# EAGLE design z21_2020_3 (EAGLE 8.4.3)
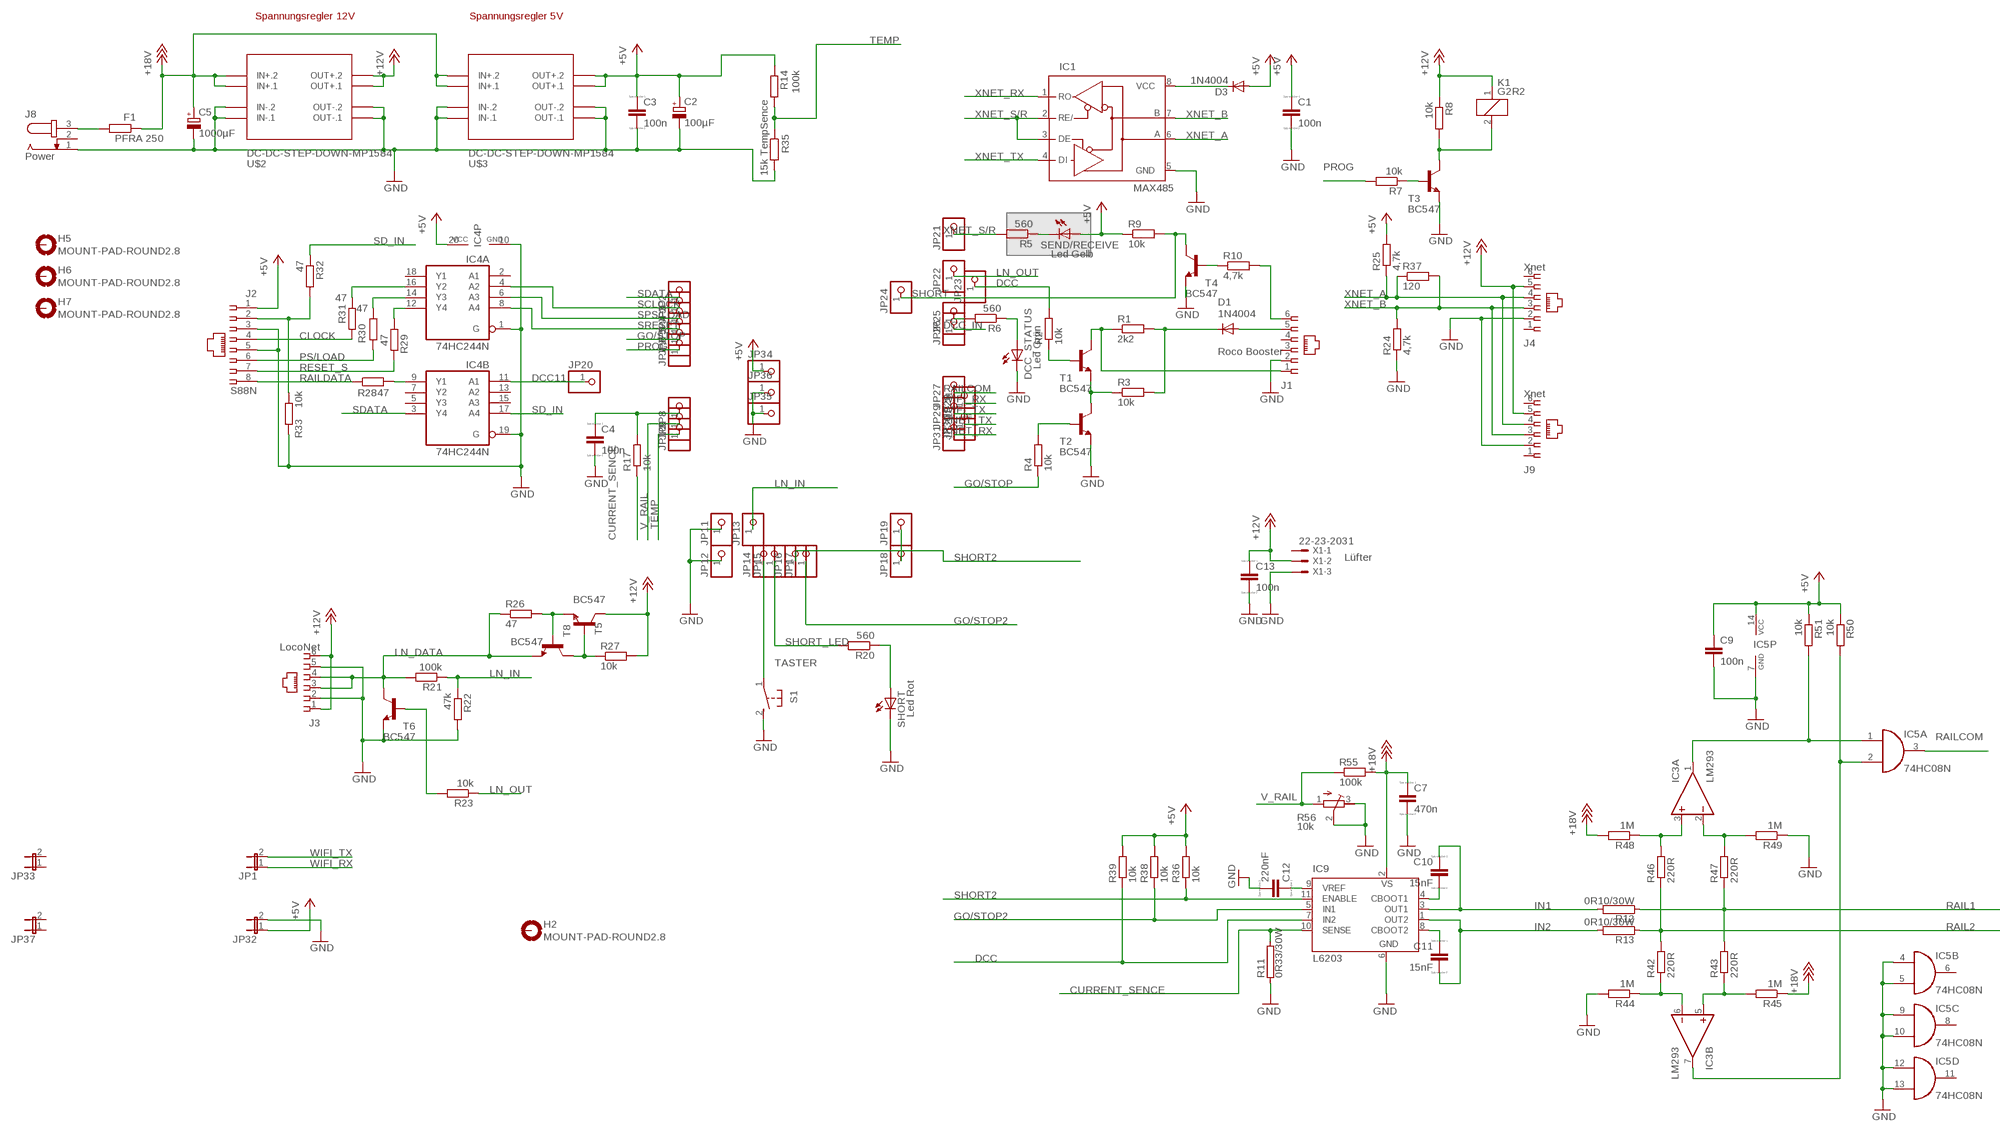
[diagram p0: schematic, sheet 1, part 1 of 2]
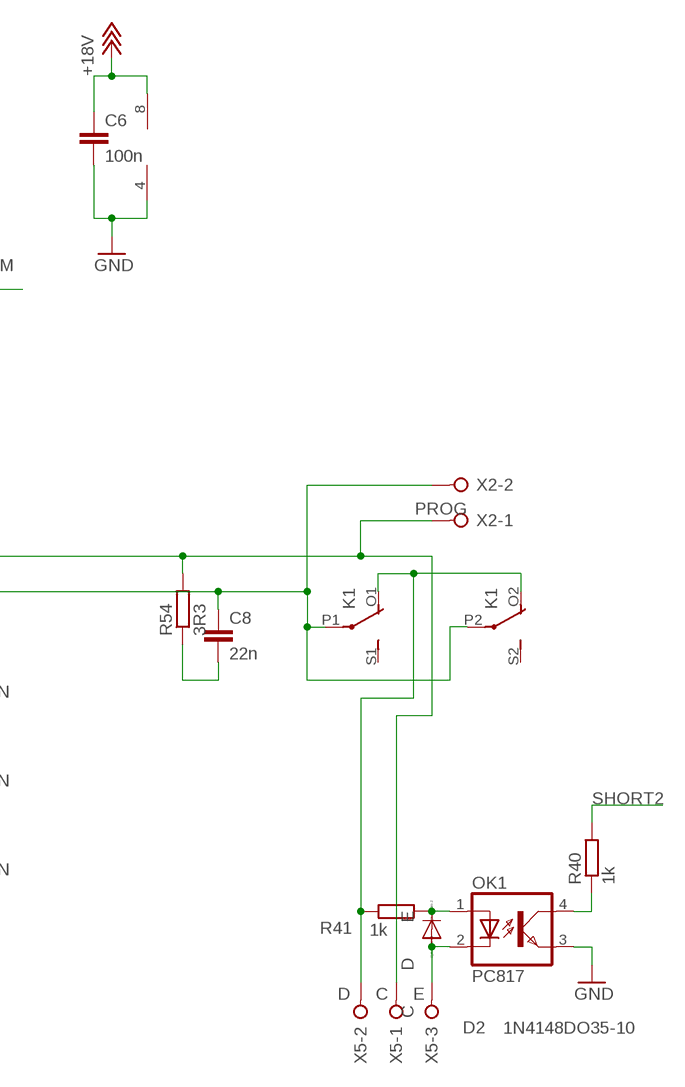
[diagram p1: schematic, sheet 1, part 2 of 2]

## Parts
C1  100n  C-EU050-024X044  [C050-024X044]
C2  100µF  CPOL-EUE3.5-10  [E3,5-10]
C3  100n  C-EU050-024X044  [C050-024X044]
C4  100n  C-EU050-024X044  [C050-024X044]
C5  1000µF  CPOL-EUE5-13  [E5-13]
C6  100n  C-EU050-024X044  [C050-024X044]
C7  470n  C-EU050-024X044  [C050-024X044]
C8  22n  C-EU050-024X044  [C050-024X044]
C9  100n  C-EU050-024X044  [C050-024X044]
C10  15nF  C-EU050-025X075  [C050-025X075]
C11  15nF  C-EU050-025X075  [C050-025X075]
C12  220nF  C-EU050-025X075  [C050-025X075]
C13  100n  C-EU050-024X044  [C050-024X044]
D1  1N4004  [DO41-10]
D2  1N4148DO35-10  [DO35-10]
D3  1N4004  [DO41-10]
DCC_STATUS  Led Grün  LEDLD260  [LD260]
F1  PFRA 250  R-EU_0204/5  [0204/5]
H2  MOUNT-PAD-ROUND2.8  [2,8-PAD]
H5  MOUNT-PAD-ROUND2.8  [2,8-PAD]
H6  MOUNT-PAD-ROUND2.8  [2,8-PAD]
H7  MOUNT-PAD-ROUND2.8  [2,8-PAD]
IC1  MAX485  MAX3468CPA  [DIL08]
IC3  LM293  LM393N  [DIL08]
IC4  74HC244N  [DIL20]
IC5  74HC08N  [DIL14]
IC9  L6203  [MULTIWATT-11]
J1  Roco Booster  520250-3  [520250-3]
J2  S88N  520251-4  [520251-4]
J3  LocoNet  520250-3  [520250-3]
J4  Xnet  520250-3  [520250-3]
J8  Power  JACK-PLUG0  [SPC4077]
J9  Xnet  520250-3  [520250-3]
JP1  JP1E  [JP1]
JP2  PINHD-1X1  [1X01]
JP3  PINHD-1X1  [1X01]
JP4  PINHD-1X1  [1X01]
JP5  PINHD-1X1  [1X01]
JP6  PINHD-1X1  [1X01]
JP7  PINHD-1X1  [1X01]
JP8  PINHD-1X1  [1X01]
JP9  PINHD-1X1  [1X01]
JP10  PINHD-1X1  [1X01]
JP11  PINHD-1X1  [1X01]
JP12  PINHD-1X1  [1X01]
JP13  PINHD-1X1  [1X01]
JP14  PINHD-1X1  [1X01]
JP15  PINHD-1X1  [1X01]
JP16  PINHD-1X1  [1X01]
JP17  PINHD-1X1  [1X01]
JP18  PINHD-1X1  [1X01]
JP19  PINHD-1X1  [1X01]
JP20  PINHD-1X1  [1X01]
JP21  PINHD-1X1  [1X01]
JP22  PINHD-1X1  [1X01]
JP23  PINHD-1X1  [1X01]
JP24  PINHD-1X1  [1X01]
JP25  PINHD-1X1  [1X01]
JP26  PINHD-1X1  [1X01]
JP27  PINHD-1X1  [1X01]
JP28  PINHD-1X1  [1X01]
JP29  PINHD-1X1  [1X01]
JP30  PINHD-1X1  [1X01]
JP31  PINHD-1X1  [1X01]
JP32  JP1E  [JP1]
JP33  JP1E  [JP1]
JP34  PINHD-1X1  [1X01]
JP35  PINHD-1X1  [1X01]
JP36  PINHD-1X1  [1X01]
JP37  JP1E  [JP1]
K1  G2R2  [G2R2]
OK1  PC817  [DIL04]
R1  2k2  R-EU_0204/7  [0204/7]
R2  10k  R-EU_0204/7  [0204/7]
R3  10k  R-EU_0207/10  [0207/10]
R4  10k  R-EU_0207/15  [0207/15]
R5  560  R-EU_0204/7  [0204/7]
R6  560  R-EU_0204/7  [0204/7]
R7  10k  R-EU_0207/10  [0207/10]
R8  10k  R-EU_0207/10  [0207/10]
R9  10k  R-EU_0207/10  [0207/10]
R10  4,7k  R-EU_0204/7  [0204/7]
R11  0R33/30W  RMNS-2  [MNS-2]
R12  0R10/30W  RMNS-2  [MNS-2]
R13  0R10/30W  RMNS-2  [MNS-2]
R14  100k  R-EU_0207/10  [0207/10]
R17  10k  R-EU_0207/10  [0207/10]
R20  560  R-EU_0204/7  [0204/7]
R21  100k  R-EU_0207/10  [0207/10]
R22  47k  R-EU_0207/10  [0207/10]
R23  10k  R-EU_0207/10  [0207/10]
R24  4,7k  R-EU_0207/10  [0207/10]
R25  4,7k  R-EU_0207/10  [0207/10]
R26  47  R-EU_0204/7  [0204/7]
R27  10k  R-EU_0207/10  [0207/10]
R28  47  R-EU_0207/10  [0207/10]
R29  47  R-EU_0207/10  [0207/10]
R30  47  R-EU_0207/10  [0207/10]
R31  47  R-EU_0207/10  [0207/10]
R32  47  R-EU_0207/10  [0207/10]
R33  10k  R-EU_0207/10  [0207/10]
R35  15k TempSence  R-EU_0204/7  [0204/7]
R36  10k  R-EU_0207/10  [0207/10]
R37  120  R-EU_0207/10  [0207/10]
R38  10k  R-EU_0207/10  [0207/10]
R39  10k  R-EU_0207/10  [0207/10]
R40  1k  R-EU_0207/10  [0207/10]
R41  1k  R-EU_0207/10  [0207/10]
R42  220R  R-EU_0207/10  [0207/10]
R43  220R  R-EU_0207/10  [0207/10]
R44  1M  R-EU_0207/10  [0207/10]
R45  1M  R-EU_0207/10  [0207/10]
R46  220R  R-EU_0207/10  [0207/10]
R47  220R  R-EU_0207/10  [0207/10]
R48  1M  R-EU_0207/10  [0207/10]
R49  1M  R-EU_0207/10  [0207/10]
R50  10k  R-EU_0207/10  [0207/10]
R51  10k  R-EU_0207/10  [0207/10]
R54  3R3  R-EU_0204/7  [0204/7]
R55  100k  R-EU_0207/12  [0207/12]
R56  10k  R-TRIMM64X  [RTRIM64X]
S1  31-XX  [B3F-31XX]
SEND/RECEIVE  Led Gelb  LEDLD260  [LD260]
SHORT  Led Rot  LEDLD260  [LD260]
T1  BC547  [TO92]
T2  BC547  [TO92]
T3  BC547  [TO92]
T4  BC547  [TO92]
T5  BC547  [TO92]
T6  BC547  [TO92]
T8  BC547  [TO92]
U$2  DC-DC-STEP-DOWN-MP1584  [DC-DC-STEP-DOWN-MP1584]
U$3  DC-DC-STEP-DOWN-MP1584  [DC-DC-STEP-DOWN-MP1584]
X1  22-23-2031  [22-23-2031]
X2  PROG  W237-02P  [W237-132]
X5  C D E  W237-3E  [W237-3E]

## Nets
+5V: C1.1 C2.+ C3.1 C9.1 D3.A IC4.20(P:VCC) IC5.14(P:VCC) J2.1 JP32.1 JP34.1 R9.1 R14.1 R25.2 R36.2 R38.2 R39.2 R50.1 R51.1 SEND/RECEIVE.A U$3.OUT+.1 U$3.OUT+.2
+12V: C13.1 J3.1 J3.6 J4.5 J9.5 K1.1 R8.1 R27.2 T5.3(C) U$2.OUT+.1 U$2.OUT+.2 X1.2
+18V: C5.+ C6.1 C7.1 F1.1 IC3.8(P:V+) IC9.2(VS) R45.1 R48.2 R55.2 U$2.IN+.1 U$2.IN+.2 U$3.IN+.1 U$3.IN+.2
CLOCK: J2.4 R31.2
CURRENT_SENCE: IC9.10(SENSE) R11.2 R17.1
DCC: IC9.7(IN2) JP23.1 R2.2 R39.1
DCC11: IC4.11(B:A1) JP20.1
DCC_IN: JP26.1
GND: C1.2 C2.- C3.2 C4.2 C5.- C6.2 C7.2 C9.2 C12.2 C13.2 DCC_STATUS.K(C) IC1.5(GND) IC3.4(P:V-) IC4.1(A:G) IC4.10(P:GND) IC4.19(B:G) IC5.4(B:I0) IC5.5(B:I1) IC5.7(P:GND) IC5.9(C:I0) IC5.10(C:I1) IC5.12(D:I0) IC5.13(D:I1) IC9.6(GND) J1.2 J2.3 J2.5 J3.2 J3.5 J4.2 J8.1 J9.2 JP11.1 JP12.1 JP32.2 JP35.1 JP36.1 OK1.3(EMIT) R11.1 R22.2 R24.1 R33.2 R35.2 R44.2 R49.1 R56.2(S) R56.3(E) S1.2(S) SHORT.K(C) T2.1(E) T3.1(E) T4.1(E) T6.1(E) U$2.IN-.1 U$2.IN-.2 U$2.OUT-.1 U$2.OUT-.2 U$3.IN-.1 U$3.IN-.2 U$3.OUT-.1 U$3.OUT-.2 X1.3
GO/STOP: JP6.1 R4.1
GO/STOP2: IC9.5(IN1) JP17.1 R38.1
IN1: C10.1 IC9.3(OUT1) R12.2
IN2: C11.2 IC9.1(OUT2) R13.2
LN_DATA: J3.3 J3.4 R21.2 R26.1 T6.3(C) T8.1(E)
LN_IN: JP13.1 R21.1 R22.1
LN_OUT: JP22.1 R23.1
N$1: J1.6 R10.2
N$2: D1.C R1.2 R3.2
N$3: D1.A J1.5
N$4: R2.1 T1.2(B)
N$5: R3.1 T1.1(E) T2.3(C)
N$6: J1.1 R1.1 T1.3(C)
N$7: JP25.1 R6.2
N$8: F1.2 J8.3
N$9: R4.2 T2.2(B)
N$10: DCC_STATUS.A R6.1
N$11: R5.1 SEND/RECEIVE.K(C)
N$12: D3.C IC1.8(VCC)
N$13: K1.2 R8.2 T3.3(C)
N$14: R7.1 T3.2(B)
N$16: R10.1 T4.2(B)
N$19: JP18.1 JP19.1
N$20: R20.1 SHORT.A
N$23: C4.1 JP8.1 R17.2
N$24: K1.O1(2:O) K1.O2(3:O) R41.2 X5.2
N$25: D2.C OK1.1(A) R41.1
N$26: R26.2 T5.1(E) T8.2(B)
N$27: R23.2 T6.2(B)
N$28: D2.A OK1.2(C) X5.3
N$29: R27.1 T5.2(B) T8.3(C)
N$30: IC4.9(B:Y1) R28.2
N$31: IC4.14(A:Y3) R30.1
N$32: IC4.16(A:Y2) R31.1
N$33: IC4.12(A:Y4) R29.1
N$34: IC3.6(B:-IN) R42.1 R44.1
N$35: J2.2 R32.2 R33.1
N$37: IC3.5(B:+IN) R43.1 R45.2
N$38: IC3.7(B:OUT) IC5.2(A:I1) R50.2
N$39: IC3.3(A:+IN) R46.2 R48.1
N$40: IC3.2(A:-IN) R47.2 R49.2
N$42: OK1.4(COL) R40.1
N$43: IC3.1(A:OUT) IC5.1(A:I0) R51.2
N$44: C10.2 IC9.4(CBOOT1)
N$45: C8.2 R54.1
N$47: C11.1 IC9.8(CBOOT2)
N$54: C12.1 IC9.9(VREF)
PROG: JP7.1 R7.2
PS/LOAD: J2.6 R30.2
RAIL1: R12.1 R43.2 R47.1 R54.2 X2.1 X5.1
RAIL2: C8.1 K1.P1(2:P) K1.P2(3:P) R13.1 R42.2 R46.1 X2.2
RAILCOM: IC5.3(A:O) JP27.1
RAILDATA: J2.8 R28.1
RESET_S: J2.7 R29.2
SCLOCK: IC4.4(A:A2) JP3.1
SD_IN: IC4.17(B:A4) R32.1
SDATA: IC4.3(B:Y4) JP2.1
SHORT: JP24.1 R9.2 T4.3(C)
SHORT2: IC9.11(ENABLE) JP16.1 R36.1 R40.2
SHORT_LED: JP15.1 R20.2
SPS/LOAD: IC4.6(A:A3) JP4.1
SRESET: IC4.8(A:A4) JP5.1
TASTER: JP14.1 S1.1(P)
TEMP: JP10.1 R14.2 R35.1
V_RAIL: JP9.1 R55.1 R56.1(A)
WIFI_RX: JP1.1 JP28.1
WIFI_TX: JP1.2 JP29.1
XNET_A: IC1.6(A) J4.4 J9.4 R25.1 R37.1
XNET_B: IC1.7(B) J4.3 J9.3 R24.2 R37.2
XNET_RX: IC1.1(RO) JP31.1
XNET_S/R: IC1.2(RE/) IC1.3(DE) JP21.1 R5.2
XNET_TX: IC1.4(DI) JP30.1
Unconnected: H2.B2,8(MOUNT) H5.B2,8(MOUNT) H6.B2,8(MOUNT) H7.B2,8(MOUNT) IC4.2(A:A1) IC4.5(B:Y3) IC4.7(B:Y2) IC4.13(B:A2) IC4.15(B:A3) IC4.18(A:Y1) IC5.6(B:O) IC5.8(C:O) IC5.11(D:O) J1.3 J1.4 J4.1 J4.6 J8.2 J9.1 J9.6 JP33.1 JP33.2 JP37.1 JP37.2 K1.S1(2:S) K1.S2(3:S) X1.1

## Notes on the sheet
- Spannungsregler 12V | Spannungsregler 5V
- Lüfter
- D     C     E

## Library data of the parts
C1 C3 C4 C7 C10-C13 = resistor:C-EU: CAPACITOR, European symbol; SPICEPREFIX: C
C2 C5 = resistor:CPOL-EU: POLARIZED CAPACITOR, European symbol
C6 C8 C9 = rcl:C-EU: CAPACITOR, European symbol
D1 D3 = diode:1N4004: DIODE general purpose rectifier, 1 A
D2 = diode:1N4148: DIODE high speed (Philips)
DCC_STATUS SEND/RECEIVE SHORT = led:LED: LED OSRAM: - CHIPLED LG R971, LG N971, LY N971, LG Q971, LY Q971, LO R971, LY R971 LH N974, LH R974 LS Q976, LO Q976, LY Q976 LO Q996 - Hyper CHIPLED LW Q18S LB Q993, LB Q99A, LB R99A - SideLED LS A670, LO A670, LY A670, LG A670, LP A670 LB A673, LV A673, LT A673, LW A673 LH A674 LY A675 LS A676, LA A676, LO A676, LY A676, LW A676 LS A679, LY A679, LG A679 - Hyper Micro SIDELED® LS Y876, LA Y876, LO Y876, LY Y876 LT Y87S - SmartLED LW L88C, LW L88S LB L89C, LB L89S, LG L890 LS L89K, LO L89K, LY L89K LS L896, LA L896, LO L896, LY L896 - TOPLED LS T670, LO T670, LY T670, LG T670, LP T670 LSG T670, LSP T670, LSY T670, LOP T670, LYG T670 LG T671, LOG T671, LSG T671 LB T673, LV T673, LT T673, LW T673 LH T674 LS T676, LA T676, LO T676, LY T676, LB T676, LH T676, LSB T676, LW T676 LB T67C, LV T67C, LT T67C, LS T67K, LO T67K, LY T67K, LW E67C LS E67B, LA E67B, LO E67B, LY E67B, LB E67C, LV E67C, LT E67C LW T67C LS T679, LY T679, LG T679 LS T770, LO T770, LY T770, LG T770, LP T770 LB T773, LV T773, LT T773, LW T773 LH T774 LS E675, LA E675, LY E675, LS T675 LS T776, LA T776, LO T776, LY T776, LB T776 LHGB T686 LT T68C, LB T68C - Hyper Mini TOPLED® LB M676 - Mini TOPLED Santana® LG M470 LS M47K, LO M47K, LY M47K Source: http://www.osram.convergy.de LUXEON: - LUMILED® LXK2-PW12-R00, LXK2-PW12-S00, LXK2-PW14-U00, LXK2-PW14-V00 LXK2-PM12-R00, LXK2-PM12-S00, LXK2-PM14-U00 LXK2-PE12-Q00, LXK2-PE12-R00, LXK2-PE12-S00, LXK2-PE14-T00, LXK2-PE14-U00 LXK2-PB12-K00, LXK2-PB12-L00, LXK2-PB12-M00, LXK2-PB14-N00, LXK2-PB14-P00, LXK2-PB14-Q00 LXK2-PR12-L00, LXK2-PR12-M00, LXK2-PR14-Q00, LXK2-PR14-R00 LXK2-PD12-Q00, LXK2-PD12-R00, LXK2-PD12-S00 LXK2-PH12-R00, LXK2-PH12-S00 LXK2-PL12-P00, LXK2-PL12-Q00, LXK2-PL12-R00 Source: www.luxeon.com KINGBRIGHT: KA-3528ASYC Source: www.kingbright.com
F1 R1-R10 R14 R17 R20-R33 R35-R41 R54 R55 = rcl:R-EU_: RESISTOR, European symbol
H2 H5-H7 = holes:MOUNT-PAD-ROUND: MOUNTING PAD, round
IC1 = maxim:MAX34*: +5V, Fail-Safe, 40Mbps, Profibus RS-485/RS-422 Transceivers Source: MAX3465-MAX3469.pdf; OC_FARNELL: unknown; OC_NEWARK: unknown
IC3 = linear:LM393: COMPARATOR
IC4 = 74xx-eu:74*244: Octal BUFFER and LINE DRIVER, 3-state
IC5 = 74xx-eu:74*08: Quad 2-input AND gate
IC9 = st-microelectronics:L6203: DMOS FULL BRIDGE DRIVER; MPN: L6203; OC_FARNELL: 1467715; OC_NEWARK: 56P8434
J1 J3 J4 J9 = con-amp:520250-3: AMP connector
J2 = con-amp:520251-4: AMP connector
J8 = con-jack:JACK-PLUG: DC POWER JACK Power Jack, DC, Right Angle, Through Hole, Rated 5A at 16VDC, PC Terminals Distributor: Farnell (www.Farnell.de) Drawing: 84N1161.pdf / 84N1162.pdf Manufacturer: SPC Technology (www.spctechnology.com) Type: SPC4077 / SPC 4078; OC_FARNELL: unknown; OC_NEWARK: unknown
JP1 JP32 JP33 JP37 = jumper:JP1E: JUMPER
JP2-JP31 JP34-JP36 = pinhead:PINHD-1X1: PIN HEADER
K1 = relay:G2R2: RELAY 2 x switch, Omron; MF: OMRON COMPONENTS USA; MPN: G2R-2-DC6; OC_FARNELL: unknown; OC_NEWARK: 89C5317
OK1 = optocoupler:PC817: SHARP OPTO COUPLER; MPN: PC817X4J000F; OC_FARNELL: 9707727; OC_NEWARK: 97K7059
R11-R13 = resistor-power:R: Power Resitor; OC_FARNELL: unknown; OC_NEWARK: unknown
R42-R51 = resistor:R-EU_: RESISTOR, European symbol
R56 = resistor:R-TRIMM: Trimm resistor
S1 = switch-omron:31-XX: OMRON SWITCH; MPN: B3F-3100; OC_FARNELL: 959704; OC_NEWARK: 36M3582
T1-T6 T8 = transistor:BC547: NPN TRANSISTOR
U$2 U$3 = diy-modules:DC-DC-STEP-DOWN-MP1584: DC/DC Step-Down Regulator based on MP1584 chip MP1584 datasheet available here: http://www.haoyuelectronics.com/Attachment/MP1584/MP1584.pdf Click here to find device on ebay.com <http://www.ebay.com/sch/mp1584+module>
X1 = con-molex:22-23-2031: .100" (2.54mm) Center Header - 3 Pin; MF: MOLEX; MPN: 22-23-2031; OC_FARNELL: 1462950; OC_NEWARK: 30C0862
X2 = con-wago-508:W237-02P: WAGO SREW CLAMP; OC_FARNELL: unknown; OC_NEWARK: unknown
X5 = con-wago-508:W237-3E: WAGO SREW CLAMP; OC_FARNELL: unknown; OC_NEWARK: unknown

## Board
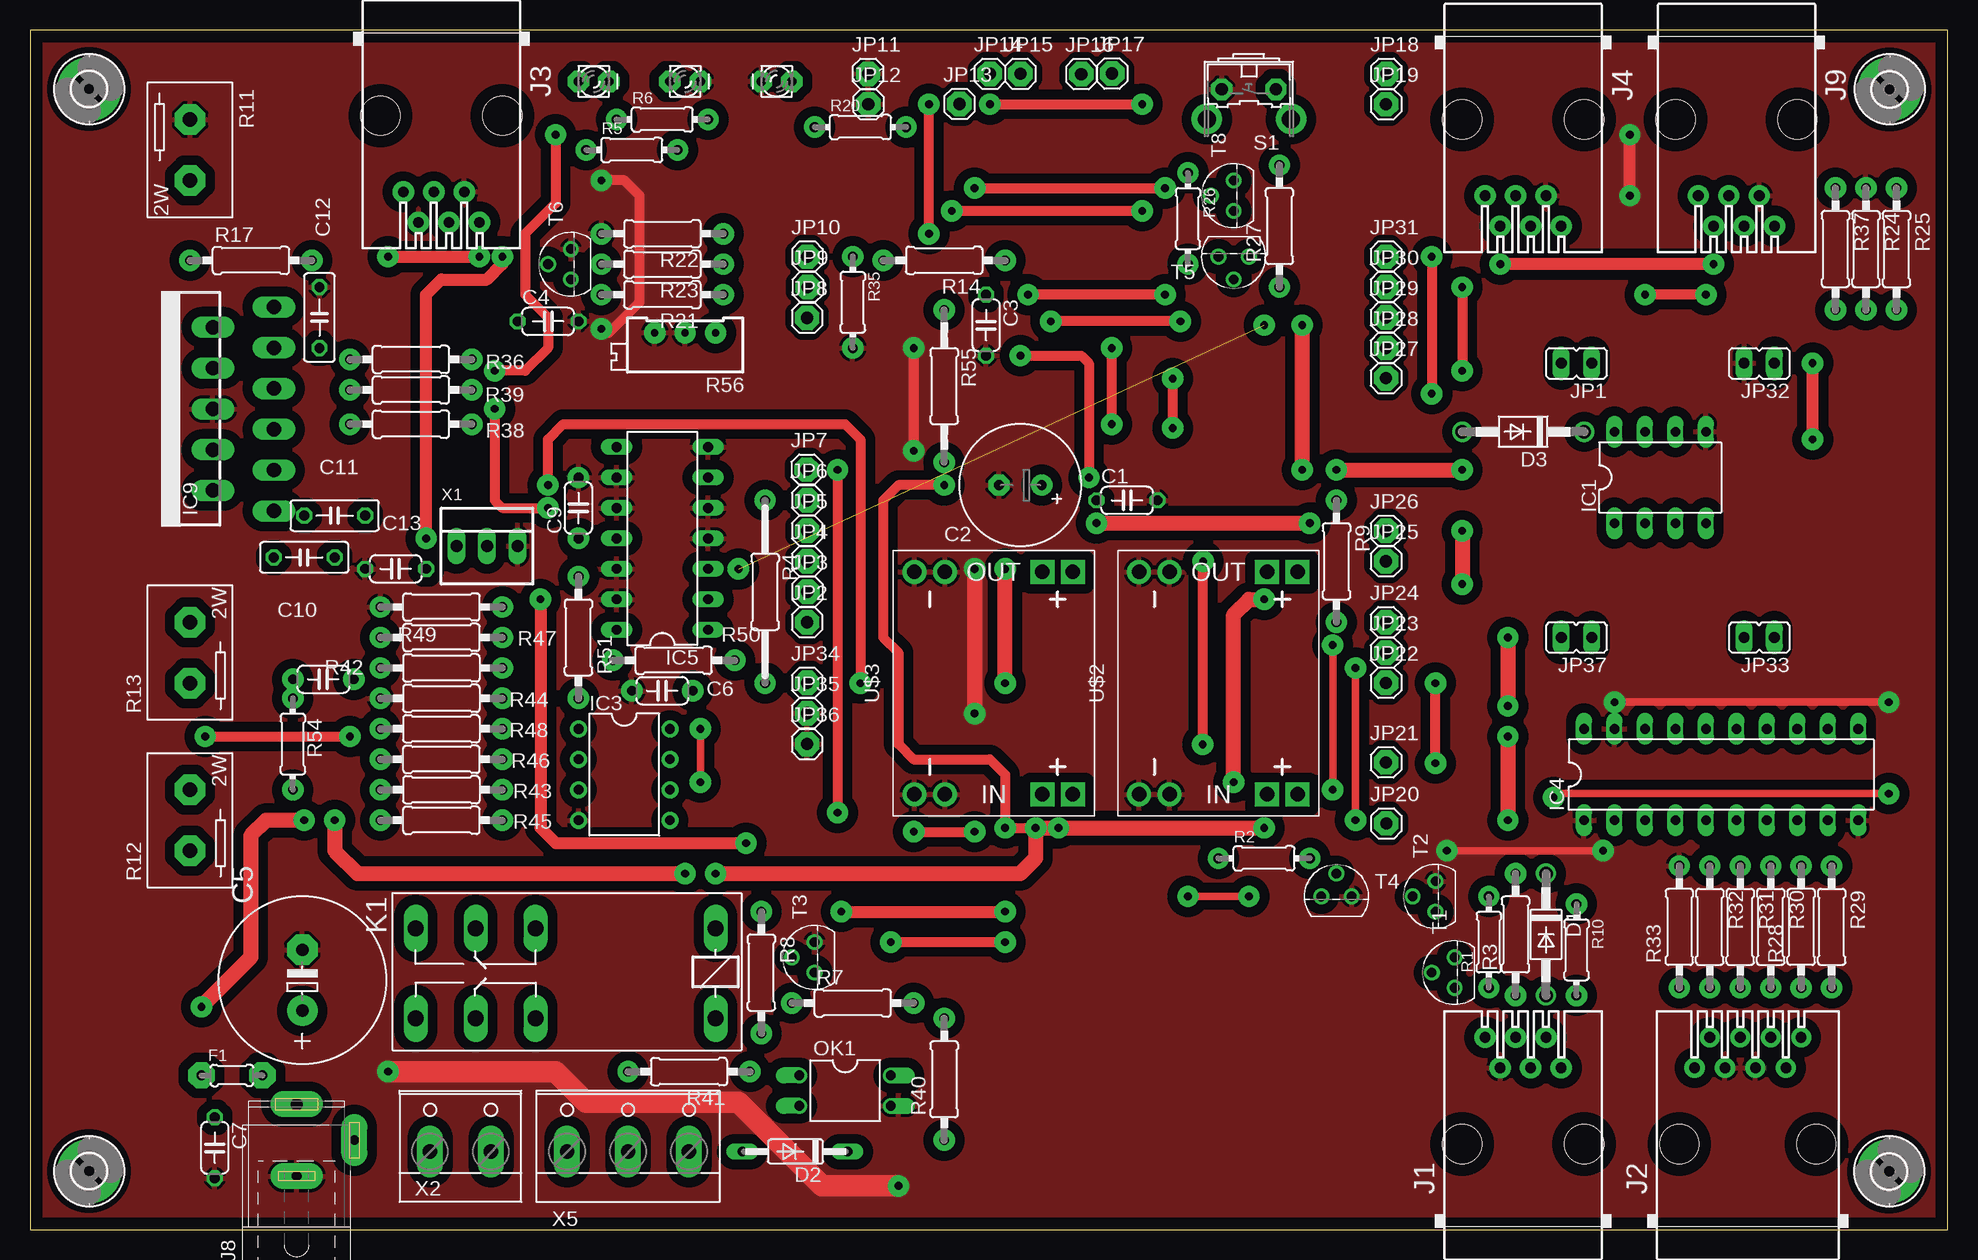
[diagram p2: board, top side]
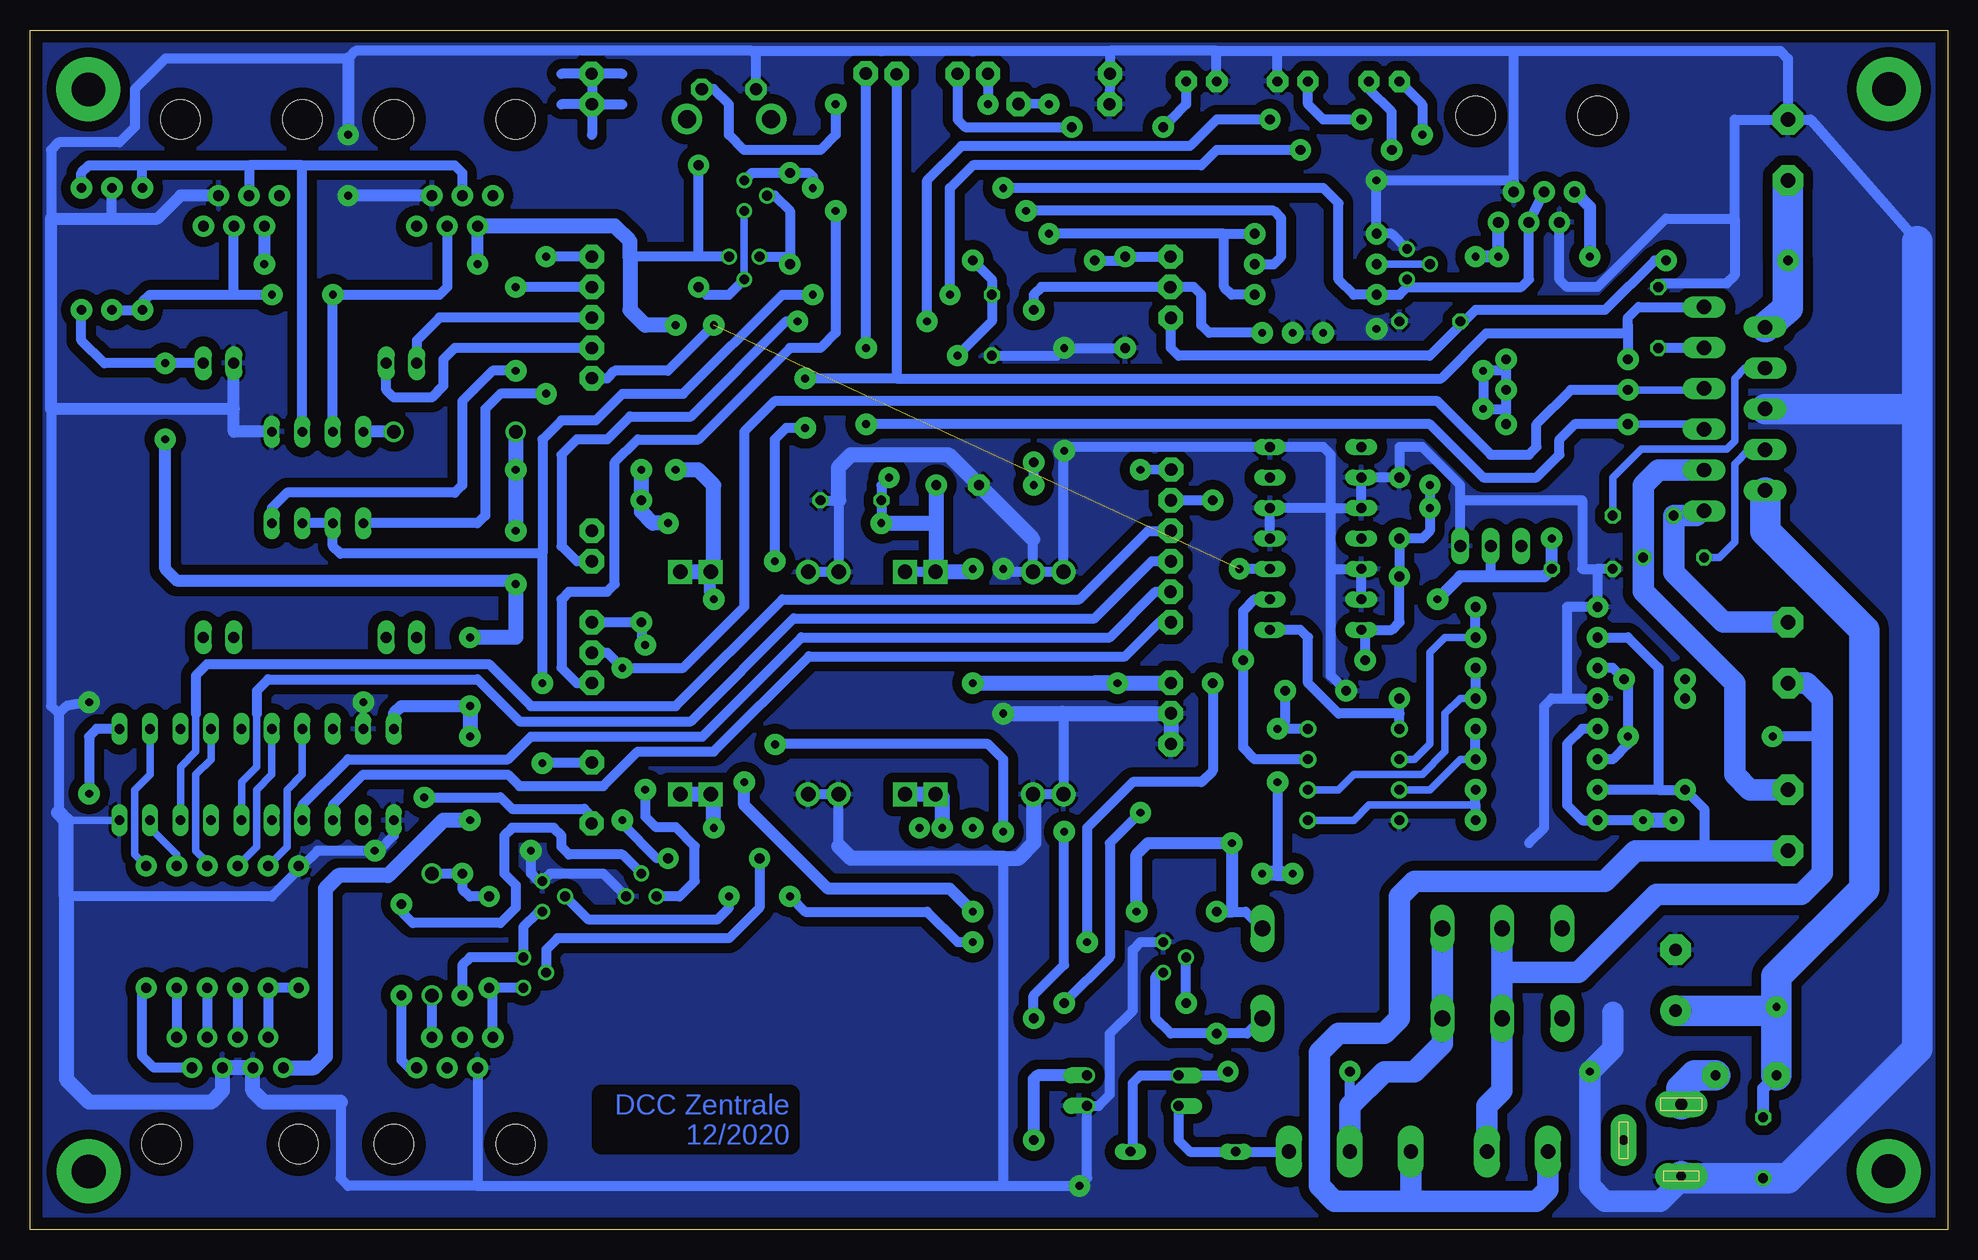
[diagram p3: board, bottom side, seen from below]

Size 159.87 x 100.01 mm. Coordinates in mm from the lower left corner, seen from the top.
Outline: 0,0 159.87,0 159.84,99.99 0,100.01 0,0
Copper layers (1+16): Top 0.035mm / dielectric 1.5mm / Bottom 0.035mm
Design rules "default *": minimum track width 10mil, minimum drill 24mil, track to track 8mil, track to pad 8mil, pad to pad 8mil, via to via 8mil, smd to smd 8mil, copper to edge 40mil, drill to drill 8mil, minimum pad ring 10mil, minimum via ring 8mil, stop-mask expansion 4mil, vias tented up to drill 0mil, thermal gap 10mil

### Footprints (pad centres in the part's own frame; a part is rotated, then mirrored left to right if it is on the bottom)
C050-024X044 = drill 0.813 octagon: 1 -2.54,0; 2 2.54,0
E3,5-10 = drill 0.813 pad 1.778: + -1.778,0 | drill 0.813 pad 1.778 octagon: - 1.778,0
E5-13 = drill 1.016 pad 2.54: + -2.54,0 | drill 1.016 pad 2.54 octagon: - 2.54,0
C050-024X044' = drill 0.813 pad 1.778: 1 -2.54,0; 2 2.54,0
C050-025X075 = drill 0.813 octagon: 1 -2.54,0; 2 2.54,0
DO41-10 = drill 1.118: A 5.08,0; C -5.08,0
DO35-10 = drill 0.813 long: A 4.445,0; C -4.318,0
LD260 = drill 0.813 pad 1.778 octagon: A -1.27,0; K 1.27,0
0204/5 = drill 0.813 pad 2.184 octagon: 1 -2.54,0; 2 2.54,0
2,8-PAD = drill 2.8 pad 5.334: B2,8 0,0
DIL08 = drill 0.813 long: 1 -3.81,-3.81; 2 -1.27,-3.81; 3 1.27,-3.81; 4 3.81,-3.81; 5 3.81,3.81; 6 1.27,3.81; 7 -1.27,3.81; 8 -3.81,3.81
DIL08' = drill 0.813 pad 1.422: 1 -3.81,-3.81; 2 -1.27,-3.81; 3 1.27,-3.81; 4 3.81,-3.81; 5 3.81,3.81; 6 1.27,3.81; 7 -1.27,3.81; 8 -3.81,3.81
DIL20 = drill 0.813 long: 1 -11.43,-3.81; 2 -8.89,-3.81; 3 -6.35,-3.81; 4 -3.81,-3.81; 5 -1.27,-3.81; 6 1.27,-3.81; 7 3.81,-3.81; 8 6.35,-3.81; 9 8.89,-3.81; 10 11.43,-3.81; 11 11.43,3.81; 12 8.89,3.81; 13 6.35,3.81; 14 3.81,3.81; 15 1.27,3.81; 16 -1.27,3.81; 17 -3.81,3.81; 18 -6.35,3.81; 19 -8.89,3.81; 20 -11.43,3.81
DIL14 = drill 0.813 long: 1 -7.62,-3.81; 2 -5.08,-3.81; 3 -2.54,-3.81; 4 0,-3.81; 5 2.54,-3.81; 6 5.08,-3.81; 7 7.62,-3.81; 8 7.62,3.81; 9 5.08,3.81; 10 2.54,3.81; 11 0,3.81; 12 -2.54,3.81; 13 -5.08,3.81; 14 -7.62,3.81
MULTIWATT-11 = drill 1.2 long: 1 -8.5,-6.35; 2 -6.8,-1.27; 3 -5.1,-6.35; 4 -3.4,-1.27; 5 -1.7,-6.35; 6 0,-1.27; 7 1.7,-6.35; 8 3.4,-1.27; 9 5.1,-6.35; 10 6.8,-1.27; 11 8.5,-6.35
520250-3 = drill 0.889 pad 1.778: 1 -3.175,8.89; 2 -1.905,6.35; 3 -0.635,8.89; 4 0.635,6.35; 5 1.905,8.89; 6 3.175,6.35 | hole 3.251: -5.08,0; 5.08,0
520251-4 = drill 0.889 pad 1.676: 1 -4.445,6.35; 2 -3.175,8.89; 3 -1.905,6.35; 4 -0.635,8.89; 5 0.635,6.35; 6 1.905,8.89; 7 3.175,6.35; 8 4.445,8.89 | hole 3.251: -5.715,0; 5.715,0
SPC4077 = drill 0.8 pad 2.184 long: 1 -3,0; 2 0,-4.8 | drill 1 pad 2.184 long: 3 3,0
JP1 = drill 0.914 long: 1 0,-1.27; 2 0,1.27
1X01 = drill 1.016 pad 2.032 octagon: 1 0,0
G2R2 = drill 1.321 long: 1 -2.54,-3.683; 2 -2.54,3.81; O1 12.471,3.81; O2 12.471,-3.683; P1 17.45,3.81; P2 17.45,-3.683; S1 22.454,3.81; S2 22.454,-3.683
DIL04 = drill 0.813 offset: 1 -1.27,-3.81; 2 1.27,-3.81; 3 1.27,3.81; 4 -1.27,3.81
0204/7 = drill 0.813 pad 1.778: 1 -3.81,0; 2 3.81,0
0207/10 = drill 0.813 pad 1.778: 1 -5.08,0; 2 5.08,0
0207/15 = drill 0.813 pad 1.778: 1 -7.62,0; 2 7.62,0
MNS-2 = drill 1.194 pad 2.54 octagon: 1 -2.54,0; 2 2.54,0
0207/12 = drill 0.813 pad 1.778: 1 -6.35,0; 2 6.35,0
RTRIM64X = drill 0.61 pad 1.778: 1 1.27,-2.54; 2 1.27,0; 3 1.27,2.54
B3F-31XX = drill 1.016 pad 1.778 octagon: 1 -2.261,-1.245; 2 2.261,-1.245 | drill 1.499 pad 2.54: 3 -3.505,1.245; 4 3.505,1.245
TO92 = drill 0.813 pad 1.27: 1 1.27,0; 2 0,1.905; 3 -1.27,0
DC-DC-STEP-DOWN-MP1584 = drill 1.2 pad 2 square: IN+.1 -9.271,-4.064; IN+.2 -9.271,-6.604; OUT+.1 9.271,-4.064; OUT+.2 9.271,-6.604 | drill 1.2 pad 2: IN-.1 -9.271,6.604; IN-.2 -9.271,4.064; OUT-.1 9.271,6.604; OUT-.2 9.271,4.064
22-23-2031 = drill 1 long: 1 -2.54,0; 2 0,0; 3 2.54,0
W237-132 = drill 1.194 pad 2.184 long: 1 -2.54,-0.635; 2 2.54,-0.635
W237-3E = drill 1.194 pad 2.184 long: 1 -5.08,-0.635; 2 0,-0.635; 3 5.08,-0.635

### Placement (x,y rotation side)
C1  91.44,60.8 0 top
C2  82.55,62.07 180 top
C3  79.69,75.41 270 top
C4  43.18,75.72 0 top
C5  22.7,20.8 90 top
C6  100n  [C050-024X044']  52.7,44.93 180 top
C7  15.4,6.83 270 top
C8  22n  [C050-024X044']  24.45,45.88 180 top
C9  100n  [C050-024X044']  45.72,60.17 90 top
C10  22.86,56.04 180 top
C11  25.4,59.53 180 top
C12  24.13,76.04 90 top
C13  30.48,55.09 180 top
D1  126.36,24.61 270 top
D2  63.82,6.51 180 top
D3  124.46,66.52 180 top
DCC_STATUS  54.61,95.73 0 top
F1  16.83,12.86 0 top
H2  4.92,95.09 0 top
H5  4.93,4.88 0 top
H6  155,95.06 0 top
H7  154.97,4.86 0 top
IC1  135.89,62.71 0 top
IC3  LM293  [DIL08']  49.53,37.94 270 top
IC4  140.97,37.94 0 top
IC5  52.7,57.63 90 top
IC9  13.97,68.42 90 top
J1  124.46,7.14 0 top
J2  143.19,7.14 0 top
J3  34.29,92.87 180 top
J4  124.46,92.55 180 top
J8  22.23,7.46 90 top
J9  142.24,92.55 180 top
JP1  128.91,72.23 90 top
JP2  64.77,50.64 0 top
JP3  64.8,53.18 0 top
JP4  64.77,55.72 0 top
JP5  64.77,58.26 0 top
JP6  64.77,60.8 0 top
JP7  64.74,63.37 0 top
JP8  64.77,76.02 0 top
JP9  64.82,78.58 0 top
JP10  64.8,81.12 0 top
JP11  69.85,96.36 0 top
JP12  69.88,93.82 0 top
JP13  77.47,93.85 0 top
JP14  80.01,96.36 0 top
JP15  82.55,96.36 0 top
JP16  87.63,96.34 0 top
JP17  90.2,96.39 0 top
JP18  113.06,96.36 0 top
JP19  113.03,93.82 0 top
JP20  113.06,33.86 0 top
JP21  113.03,38.96 0 top
JP22  113.03,45.59 0 top
JP23  113.03,48.1 0 top
JP24  113.03,50.64 0 top
JP25  113.03,55.72 0 top
JP26  113.03,58.26 0 top
JP27  113.03,70.99 0 top
JP28  113.03,73.5 0 top
JP29  113.03,76.04 0 top
JP30  113.03,78.58 0 top
JP31  113.03,81.12 0 top
JP32  144.15,72.23 90 top
JP33  144.15,49.37 90 top
JP34  64.77,45.59 0 top
JP35  64.77,43.05 0 top
JP36  64.77,40.48 0 top
JP37  128.91,49.37 90 top
K1  54.61,21.43 180 top
OK1  67.94,11.59 270 top
R1  121.6,23.97 90 top
R2  102.87,30.96 0 top
R3  123.83,24.61 90 top
R4  61.28,53.18 270 top
R5  50.16,90.01 0 top
R6  52.7,92.55 0 top
R7  68.58,18.89 0 top
R8  60.96,21.43 270 top
R9  108.9,55.72 270 top
R10  128.91,23.34 270 top
R11  13.34,90.01 270 top
R12  13.34,34.13 90 top
R13  13.34,48.1 90 top
R14  76.2,80.8 180 top
R17  18.41,80.8 0 top
R20  69.22,91.92 0 top
R21  52.7,77.95 180 top
R22  52.7,83.03 180 top
R23  52.7,80.49 180 top
R24  153.03,81.76 270 top
R25  155.57,81.76 270 top
R26  96.52,84.3 270 top
R27  104.14,83.66 90 top
R28  147.64,25.24 90 top
R29  150.18,25.24 270 top
R30  145.1,25.24 270 top
R31  142.56,25.24 270 top
R32  140.02,25.24 270 top
R33  137.48,25.24 90 top
R35  68.58,77.31 270 top
R36  31.75,72.55 0 top
R37  150.5,81.76 270 top
R38  31.75,67.15 0 top
R39  31.75,70.01 0 top
R40  76.2,12.54 90 top
R41  54.93,13.18 180 top
R42  34.29,46.83 180 top
R43  34.29,36.67 180 top
R44  34.29,44.29 180 top
R45  34.29,34.13 0 top
R46  34.29,39.21 0 top
R47  34.29,49.37 0 top
R48  34.29,41.75 180 top
R49  34.29,51.91 0 top
R50  53.66,47.47 0 top
R51  45.72,49.37 270 top
R54  21.91,40.48 270 top
R55  76.2,70.33 270 top
R56  54.61,73.5 90 top
S1  101.6,93.82 180 top
SEND/RECEIVE  46.99,95.73 0 top
SHORT  62.23,95.73 180 top
T1  118.75,21.43 90 top
T2  117.16,27.78 90 top
T3  65.41,22.7 90 top
T4  108.9,27.78 0 top
T5  100.33,81.12 180 top
T6  45.09,80.49 90 top
T8  100.33,86.2 90 top
U$2  99.06,45.56 90 top
U$3  80.33,45.56 90 top
X1  38.1,56.99 0 top
X2  35.88,7.14 0 top
X5  49.85,7.14 0 top

### Tracks (layer width: path | path; a pad name or v marks a point on that pad's centre or on a via)
+5V  (via drill 0.65 pad 1.78)
  Top 0.813: v38.73,71.6 41.27,71.6 43.18,73.5 43.18,76.04 41.27,77.95 41.27,83.03 43.81,85.57 v43.81,91.28 | v38.73,68.42 38.73,60.8 39.37,60.17 v43.18,60.17 | v43.18,62.07 43.18,65.88 44.45,67.15 67.94,67.15 69.22,65.88 v69.22,45.56 | v82.55,72.87 87.63,72.87 88.27,72.23 v88.27,62.71
  Top 1.016: v148.59,65.88 v148.59,72.23
  Top 1.27: v81.28,45.56 v81.28,55.09 | v108.9,63.34 v119.38,63.34 | v88.9,58.9 v106.68,58.9 | v119.38,58.26 v119.38,53.82 | v123.19,49.37 v123.19,43.66 | v123.19,41.12 v123.19,34.13
  Bottom 0.813: 36.83,71.6 R39.2 36.83,68.42 | 36.83,68.42 R38.2 | U$3.OUT+.1 U$3.OUT+.2 | R50.1 48.58,49.69 IC5.14 46.35,50.01 45.72,50.64 R51.1 C9.1 43.81,57.63 43.18,58.26 v43.18,60.17 v43.18,62.07 | JP32.1 v148.59,72.23 153.67,72.23 155.57,74.14 R25.2 | v43.81,91.28 43.81,93.82 SEND/RECEIVE.A | 36.83,71.6 v38.73,71.6 v38.73,68.42 36.83,68.42 | R36.2 36.83,71.6 | R14.1 79.69,79.22 C3.1 79.69,75.72 v82.55,72.87 | v88.9,58.9 C1.1 88.9,62.07 v88.27,62.71
  Bottom 1.016: v148.59,65.88 148.59,55.09 147.64,54.13 119.7,54.13 v119.38,53.82 | v123.19,43.66 128.91,43.66 129.54,43.02 IC4.20
  Bottom 1.27: 64.8,45.56 JP34.1 71.09,45.59 v69.22,45.56 v81.28,45.56 | J2.1 136.21,13.49 135.25,14.45 135.25,28.42 134.14,29.53 130.02,29.53 125.41,34.13 v123.19,34.13 | C2.+ 84.33,58.9 | 84.33,58.9 84.33,54.83 U$3.OUT+.1 81.53,54.83 v81.28,55.09 | v108.9,63.34 R9.1 108.9,59.85 107.95,58.9 v106.68,58.9 | D3.A v119.38,63.34 v119.38,58.26 | v88.9,58.9 84.33,58.9 | v123.19,49.37 119.38,49.37 v119.38,53.82 | v123.19,43.66 v123.19,41.12
+12V  (via drill 0.65 pad 1.78)
  Top 1.016: v140.34,80.49 v122.56,80.49 | v33.02,57.63 33.02,77.95 34.29,79.22 38.1,79.22 39.37,80.49 v39.37,81.12 | v29.84,81.12 v37.47,81.12 | v42.55,52.55 42.55,33.5 43.81,32.23 v59.69,32.23 | v67.63,26.51 v81.28,26.51
  Top 1.27: v106.05,63.34 v106.05,75.41 | v100.33,37.31 100.33,51.28 101.6,52.55 v102.87,52.55
  Bottom 0.813: K1.1 58.55,26.51 59.69,26.51 | T5.3 104.14,81.12 | 104.14,81.12 R27.2 | 38.1,54.45 X1.2 | 37.48,83.95 J3.1 | 37.48,81.13 v37.47,81.12 | 104.14,81.12 109.86,81.12
  Bottom 1.016: R8.1 59.69,26.51 v59.69,32.23 66.67,32.23 67.63,31.27 v67.63,26.51 | J9.5 v140.34,80.49 | v122.56,80.49 J4.5 121.92,83.66 | v33.02,57.63 C13.1 33.66,54.45 38.1,54.45 40.64,54.45 v42.55,52.55 | J3.6 29.84,85.25 v29.84,81.12 | 37.48,81.13 37.48,83.95 | v37.47,81.12 v39.37,81.12 | v81.28,26.51 83.19,28.42 93.34,28.42 100.33,35.4 v100.33,37.31 | v102.87,52.55 102.55,52.55 103.19,53.18 103.19,54.77 U$2.OUT+.1
  Bottom 1.27: v106.05,63.34 104.14,63.34 102.87,62.07 102.87,55.09 U$2.OUT+.1 U$2.OUT+.2 | v106.05,75.41 108.58,75.41 109.86,76.68 109.86,81.12 109.86,82.39 111.12,83.66 121.92,83.66
+18V  (via drill 0.65 pad 1.78)
  Top 0.61: v55.88,41.75 v55.88,37.31
  Top 0.813: v76.2,62.07 72.39,62.07 71.12,60.8 71.12,49.37 72.39,48.1 72.39,40.48 73.66,39.21 80.01,39.21 81.28,37.94 v81.28,33.5 v83.82,33.5
  Top 1.27: v14.29,18.57 18.41,22.7 18.41,32.86 19.68,34.13 v22.86,34.13 | v25.4,34.13 25.4,31.59 27.3,29.69 v54.61,29.69 | v102.87,33.5 v85.72,33.5 v83.82,33.5 83.82,30.96 82.55,29.69 v57.15,29.69
  Bottom 0.61: 55.24,41.75 55.24,42.39
  Bottom 0.813: R48.2 30.48,41.75 31.75,40.48 31.75,35.4 30.48,34.13 R45.1 v25.4,34.13 | IC3.8 55.24,41.75 | C6.1 55.24,42.39 v55.88,41.75 | v55.88,37.31 55.88,29.69 | R55.2 v76.2,62.07
  Bottom 1.016: C7.1 15.4,11.75 F1.1
  Bottom 1.27: 15.24,61.44 IC9.2 | U$3.IN+.2 U$3.IN+.1 83.82,36.04 v83.82,33.5 | U$2.IN+.2 U$2.IN+.1 102.87,36.04 v102.87,33.5 | v22.86,34.13 v25.4,34.13 | v54.61,29.69 55.88,29.69 v57.15,29.69
  Bottom 2.54: 14.29,17.62 F1.1 | 14.92,18.26 14.29,17.62 | C5.+ 14.92,18.26 | 14.29,17.62 14.29,21.11 6.99,28.42 6.99,50.01 15.24,58.26 15.24,61.44 | v14.29,18.57 14.61,18.57 14.92,18.26
CLOCK
  Bottom 0.813: R31.2 J2.4
CURRENT_SENCE
  Bottom 2.54: R11.2 R17.1 13.34,76.81 IC9.10
DCC  (via drill 0.65 pad 1.78)
  Top 0.61: v110.49,46.83 v110.49,34.13
  Bottom 0.61: IC9.7 20.43,70.01 R39.1
  Bottom 0.813: R39.1 31.43,70.01 34.29,67.15 34.29,65.25 34.92,64.61 38.1,64.61 42.55,69.06 97.79,69.06 100.33,66.52 100.33,51.91 105.41,46.83 v110.49,46.83 111.76,48.1 JP23.1 | v110.49,34.13 110.49,33.81 107.63,30.96 R2.2
DCC11  (via drill 0.65 pad 1.78)
  Top 0.61: v154.94,36.35 127.32,36.35 v127,36.04
  Bottom 0.813: IC4.11 154.31,41.75 154.94,41.12 v154.94,36.35 | v127,36.04 120.65,36.04 119.7,35.08 113.67,35.08 113.08,34.5 JP20.1
GND  (via drill 0.65 pad 1.78)
  Top 0.61: v132.08,43.97 v154.94,43.97 | v118.11,31.59 v131.13,31.59
  Top 0.813: v73.66,73.5 v73.66,64.93 | v47.62,75.09 48.26,74.77 50.8,77.31 50.8,86.2 49.53,87.47 v47.62,87.47
  Top 1.016: v133.35,86.2 v133.35,91.28
  Top 1.27: v78.74,55.09 v78.74,43.02
  Top 1.778: v72.39,3.65 66.04,3.65 59.05,10.64 46.35,10.64 43.81,13.18 v29.84,13.18
  Bottom 0.61: 156.84,34.13 IC4.10 | IC4.19 v132.08,43.97
  Bottom 0.813: 2.54,82.39 11.43,92.55 R11.1 | C12.2 23.81,78.9 18.41,78.9 17.78,79.53 17.78,84.3 | 17.78,84.3 17.78,92.55 R11.1 | 73.81,43.04 73.81,43.05 | U$2.IN-.2 U$2.IN-.1 92.46,31.97 | U$2.OUT-.2 U$2.OUT-.1 92.46,60.8 C1.2 | IC5.4 IC5.5 51.44,60.17 | 51.44,60.17 IC5.10 IC5.9 C9.2 45.72,65.25 43.81,65.25 40.64,62.07 40.64,60.8 | 51.44,60.17 51.44,64.61 52.07,65.25 IC5.7 73.34,65.25 73.72,64.87 | IC5.13 IC5.12 51.44,55.09 | 51.44,55.09 51.44,60.17 | C6.2 51.44,46.2 51.44,55.09 | 31.75,44.29 31.75,51.91 R49.1 29.21,55.09 | 31.75,44.29 R44.2 | 40.64,60.8 30.48,60.8 30.48,55.09 29.21,55.09 | 34.92,32.23 33.66,33.5 33.66,43.66 33.02,44.29 31.75,44.29 | 143.51,13.49 J2.5 | v154.94,43.97 156.84,43.66 157.48,43.02 | 157.48,43.02 157.48,34.77 | IC4.1 129.54,32.86 130.81,31.59 v131.13,31.59 135.89,31.59 137.16,30.32 | 137.16,30.32 139.7,27.78 156.84,27.78 | 73.72,64.87 73.72,65.25 v73.66,64.93 | 73.72,64.87 U$3.OUT-.1 U$3.OUT-.2 | T3.1 67.31,23.97 67.94,23.34 67.94,18.26 69.85,16.35 69.85,11.27 70.8,10.32 OK1.3 71.75,4.29 v72.39,3.65 78.74,3.65 | 153.03,84.3 R24.1 | 158.12,84.3 158.12,90.01 157.48,90.65 152.4,90.65 151.13,91.92 151.13,95.09 148.59,97.63 133.35,97.63 132.72,98.27 99.69,98.27 | 158.12,68.42 158.12,43.66 157.48,43.02 | T6.1 46.35,83.03 R22.2 v47.62,87.47 36.2,87.47 | 36.2,87.47 J3.2 | 36.2,87.47 36.2,98.27 | 17.78,84.3 23.5,84.3 29.21,78.58 31.75,78.58 32.38,79.22 J3.5 | JP12.1 JP11.1 69.85,98.27 | 45.72,76.04 C4.2 | R35.2 v73.66,73.5 74.3,72.87 C3.2 | 55.88,98.27 36.2,98.27 | 60.96,98.27 55.88,98.27 | 60.96,98.27 69.85,98.27 | DCC_STATUS.K 55.88,98.27 | U$3.OUT-.2 76.26,57.56 | U$3.OUT-.2 78.49,54.83
  Bottom 0.813: 73.72,42.95 U$3.IN-.1 U$3.IN-.2 | 99.69,98.27 69.85,98.27 | S1.2 99.34,97.99 99.69,98.27 | 78.74,3.65 78.74,30.96 | 133.99,10.64 133.99,4.29 133.35,3.65 122.56,3.65 | 122.56,3.65 78.74,3.65 | C13.2 29.21,55.09 | X1.3 40.64,60.8 | SHORT.K 60.96,98.27 | 36.2,98.27 13.97,98.27 13.34,97.63 R11.1 | J1.2 122.56,3.65 | R33.2 137.16,30.32 | v118.11,31.59 118.11,29.69 117.47,29.05 T2.1 116.52,29.69 112.08,29.69 T4.1
  Bottom 1.016: J9.2 147.32,86.2 149.22,84.3 153.03,84.3 158.12,84.3 158.12,68.42 142.88,68.42 | 133.35,97.63 v133.35,91.28 | J4.2 v133.35,86.2 | IC1.5 142.88,66.52 142.88,68.42 | 142.88,68.42 JP32.2
  Bottom 1.27: U$3.IN-.2 76.2,36.04 76.2,32.23 77.47,30.96 78.74,30.96 91.44,30.96 92.46,31.97 | 133.99,10.64 140.34,10.64 141.29,11.59 J2.3 143.51,13.49 | J2.5 143.83,11.59 144.78,10.64 154.94,10.64 156.84,12.54 156.84,27.78 156.84,34.13 157.48,34.77 | 76.26,57.56 C2.- 83.31,64.61 91.44,64.61 92.46,63.6 92.46,60.8 | 78.49,54.83 v78.74,55.09 | v78.74,43.02 73.83,43.02 73.81,43.04 73.72,42.95 | 73.81,43.05 JP35.1 JP36.1
  Bottom 1.778: 27.94,18.1 27.94,15.08 v29.84,13.18 29.84,3.65 28.57,2.38 23.95,2.38 22.05,4.29
  Bottom 2.54: J8.1 22.05,4.29 C7.2 13.34,4.29 2.54,15.08 2.54,68.42 | IC9.6 2.54,68.42 | 2.54,68.42 2.54,82.39
  pour Bottom (isolate 0.813): 0,100.01 159.86,100.01 159.86,-0.16 0,-0.16
  pour Top (isolate 0.813): 0,100.01 160.02,100.01 160.02,-0.16 0,-0.16
GO/STOP
  Bottom 0.813: R4.1 JP6.1
GO/STOP2  (via drill 0.65 pad 1.78)
  Top 0.813: v90.17,67.15 v90.17,73.5
  Bottom 0.61: IC9.5 20.75,67.15 R38.1
  Bottom 0.813: R38.1 31.11,67.15 32.38,65.88 32.38,64.61 34.29,62.71 38.73,62.71 43.18,67.15 v90.17,67.15 | v90.17,73.5 90.17,96.36 JP17.1
IN1
  Bottom 1.778: R12.2 16.51,36.67 17.78,37.94 17.78,45.56 25.4,53.18 C10.1 25.4,62.07 24.13,63.34 20.34,63.34 IC9.3
IN2
  Bottom 1.778: IC9.1 20.57,59.92 20.95,59.53 C11.2 22.86,54.77 18.73,50.64 R13.2
LN_DATA  (via drill 0.65 pad 1.78)
  Top 0.813: v78.74,86.84 v94.61,86.84
  Bottom 0.813: J3.4 J3.3 34.92,79.22 35.56,78.58 45.09,78.58 | 45.09,78.58 T6.3 | 45.09,78.58 45.72,77.95 R21.2 49.53,77.95 50.8,79.22 50.8,85.57 52.07,86.84 v78.74,86.84 | T8.1 99.69,88.11 R26.1 94.93,88.11 94.61,87.79 v94.61,86.84
LN_IN  (via drill 0.65 pad 1.78)
  Top 0.813: v74.93,83.03 v74.93,93.82
  Bottom 0.813: R21.1 59.69,77.95 60.33,78.58 60.33,83.03 | 60.33,83.03 R22.1 | v74.93,93.82 JP13.1 | 60.33,83.03 v74.93,83.03
LN_OUT  (via drill 0.65 pad 1.78)
  Top 0.813: v76.83,84.93 v92.71,84.93
  Bottom 0.813: R23.1 56.2,80.49 55.56,81.12 55.56,84.3 56.2,84.93 v76.83,84.93 | v92.71,84.93 92.71,74.77 93.98,73.5 96.52,73.5 104.14,65.88 109.22,65.88 111.12,63.98 111.12,53.82 111.76,53.18 114.94,53.18 115.57,52.55 115.57,46.83 114.3,45.56 JP22.1
N$1
  Bottom 0.813: J1.6 128.27,13.49 128.91,14.13 R10.2
N$2
  Bottom 0.813: R1.2 123.19,27.78 123.83,28.42 R3.2 D1.C
N$3
  Bottom 0.813: J1.5 D1.A
N$4
  Bottom 0.813: R2.1 99.06,26.83 101.6,24.29 115.89,24.29 116.84,23.34 T1.2
N$5
  Bottom 0.813: T2.3 117.47,26.51 118.75,25.24 T1.1 123.19,22.7 123.83,22.07 R3.1
N$6
  Bottom 0.61: R1.1 121.28,20.16 T1.3
  Bottom 0.813: J1.1 121.28,20.16 | T1.3 R1.1
N$7  (via drill 0.65 pad 1.78)
  Top 0.813: v95.89,75.72 v85.09,75.72
  Bottom 0.813: JP25.1 114.3,55.72 115.57,56.99 115.57,64.61 114.3,65.88 111.76,65.88 109.86,67.79 104.78,67.79 96.84,75.72 v95.89,75.72 | R6.2 60.96,92.55 63.18,90.33 82.23,90.33 85.09,87.47 v85.09,75.72
N$8
  Bottom 2.54: J8.3 22.23,11.75 21.11,12.86 F1.2
N$9  (via drill 0.65 pad 1.78)
  Top 0.61: v101.6,27.78 v96.52,27.78
  Top 0.813: v71.75,23.97 v81.28,23.97
  Bottom 0.813: R4.2 61.28,38.26 62.23,37.31 67.94,37.31 71.75,33.5 v71.75,23.97 | T2.2 113.35,25.88 102.55,25.88 101.6,26.83 v101.6,27.78 | v96.52,27.78 95.25,26.51 85.09,26.51 82.55,23.97 v81.28,23.97
N$10
  Bottom 0.813: DCC_STATUS.A 53.34,93.82 52.07,92.55 R6.1
N$11
  Bottom 0.813: R5.1 46.35,93.19 48.26,95.09 SEND/RECEIVE.K
N$12
  Bottom 1.016: D3.C IC1.8
N$13
  Bottom 0.813: K1.2 58.42,16.35 R8.2 64.77,16.35 66.04,17.62 66.04,21.11 65.72,21.43 T3.3
N$14
  Bottom 0.813: R7.1 T3.2
N$16
  Bottom 0.813: T4.2 110.49,31.27 114.94,31.27 115.57,31.91 115.57,32.86 116.2,33.5 119.7,33.5 120.33,32.86 120.33,29.69 119.38,28.73 119.38,26.83 120.65,25.56 127.95,25.56 128.91,26.51 R10.1
N$19
  Bottom 0.813: 115.57,96.36 110.49,96.36 JP18.1 113.03,96.34 JP19.1 | JP19.1 110.49,93.82 | JP19.1 115.57,93.82 | JP19.1 113.03,91.28
N$20
  Bottom 0.813: SHORT.A 63.5,93.82 64.77,92.55 R20.1
N$23
  Bottom 0.813: R17.2 24.45,80.8 28.57,76.68 39.37,76.68 40.32,75.72 | 40.32,75.72 43.18,72.87 64.14,72.87 64.77,73.5 JP8.1 | C4.1 40.32,75.72
N$24
  Bottom 0.813: 49.85,10.32 R41.2
  Bottom 1.778: K1.O2 K1.O1 42.14,15.49 44.45,13.18 46.99,13.18 49.85,10.32 49.85,10 X5.2
N$25
  Bottom 0.813: D2.C 67.94,6.7 67.94,12.22 67.31,12.86 OK1.1 60.33,12.86 R41.1
N$26
  Bottom 0.813: T8.2 97.79,86.2 96.52,84.93 96.52,81.12 | 96.52,81.12 R26.2 | T5.1 96.52,81.12
N$27
  Bottom 0.61: R23.2 T6.2
N$28
  Bottom 0.813: OK1.2 64.14,7.46 63.18,6.51 D2.A X5.3
N$29
  Bottom 0.61: T8.3 T5.2
  Bottom 0.813: T5.2 101.6,77.95 103.5,77.95 R27.1
N$30
  Bottom 0.61: R28.2 147.64,31.27 149.86,33.5 IC4.9
N$31
  Bottom 0.61: R30.1 145.1,30.64 146.05,31.59 146.05,37.94 144.78,39.21 IC4.14
N$32
  Bottom 0.61: R31.1 140.97,31.91 140.97,36.67 139.7,37.94 IC4.16
N$33
  Bottom 0.61: R29.1 151.13,31.27 151.13,36.67 149.86,37.94 IC4.12
N$34
  Bottom 0.61: R44.1 40.64,44.29 41.91,43.02 41.91,39.85 43.81,37.94 49.53,37.94 50.8,36.67 IC3.6
  Bottom 0.813: R42.1 R44.1
N$35
  Bottom 0.813: R33.1 R32.2 J2.2
N$37
  Bottom 0.61: IC3.5 49.53,34.13 48.26,35.4 39.37,35.4
  Bottom 0.813: R45.2 39.37,35.4 R43.1
N$38
  Bottom 0.813: IC5.2 57.78,52.55 58.74,51.59 R50.2 58.74,40.16 57.78,39.21 IC3.7
N$39
  Bottom 0.61: IC3.3 43.18,36.67 40.64,39.21 R46.2
  Bottom 0.813: R46.2 R48.1
N$40
  Bottom 0.61: IC3.2 44.45,39.21 43.18,40.48 43.18,48.1 41.91,49.37 R47.2
  Bottom 0.813: R47.2 R49.2
N$42
  Bottom 1.016: OK1.4 75.88,12.86 76.2,12.54 R40.1
N$43
  Bottom 0.813: 45.72,43.02 R51.2 | IC5.1 53.98,50.01 53.34,49.37 53.34,45.56 50.8,43.02 45.72,43.02 | IC3.1 45.72,43.02
N$44
  Bottom 0.61: C10.2 19.05,56.04 17.78,57.31 17.78,63.82 16.58,65.02 IC9.4
N$45
  Bottom 0.813: R54.1 C8.2
N$47
  Bottom 0.61: C11.1 27.94,62.71 25.56,65.09 18.41,65.09 17.78,65.72 17.78,70.96 16.92,71.82 IC9.8
N$54
  Bottom 0.61: IC9.9 20.34,73.5
  Bottom 0.813: 20.34,73.5 C12.1
PROG  (via drill 0.65 pad 1.78)
  Top 0.813: v67.31,63.34 v67.31,34.77
  Bottom 0.813: JP7.1 65.38,63.37 v67.31,63.34 | v67.31,34.77 69.85,32.23 69.85,22.7 R7.2
PS/LOAD
  Bottom 0.813: R30.2 J2.6
RAIL1
  Bottom 0.813: 24.13,36.67 24.13,46.83 26.67,49.37 R47.1 | 24.13,36.67 R43.2 | 20.32,31.59 20.32,35.08 R54.2 24.13,36.67
  Bottom 1.778: R12.1 20.32,31.59 26.04,31.59 28.57,29.05 44.45,29.05 45.72,27.78 45.72,17.62 46.99,16.35 50.8,16.35 52.39,14.76 52.39,3.65 51.12,2.38 44.77,2.38 | X2.1 33.34,3.33 34.29,2.38 44.77,2.38 | 44.77,2.38 X5.1
RAIL2  (via drill 0.65 pad 1.78)
  Top 0.813: v14.61,41.12 v26.67,41.12
  Bottom 0.813: R46.1 27.94,39.21 26.67,40.48 v26.67,41.12 26.67,45.56 C8.1 27.94,46.83 R42.2 | 10.48,41.12 v14.61,41.12
  Bottom 1.778: X2.2 38.42,10.32 37.16,11.58 K1.P1 37.16,21.43 | 37.16,21.43 K1.P2 | 37.16,21.43 30.8,21.43 24.29,27.94 12.22,27.94 10.48,29.69 10.48,40.48 10.48,41.12 10.48,44.29 11.75,45.56 R13.1
RAILCOM  (via drill 0.65 pad 1.78)  (1 unrouted)
  Bottom 0.813: JP27.1 112.42,70.99 111.76,70.96 111.12,71.6 106.68,71.6 v102.87,75.41 | IC5.3 v59.05,55.09
RAILDATA
  Bottom 0.813: R28.1 J2.8
RESET_S
  Bottom 0.813: J2.7 149.54,13.49 150.5,14.45 150.5,19.84 R29.2
SCLOCK
  Bottom 0.61: 64.77,53.18 JP3.1
  Bottom 0.813: IC4.4 137.16,35.4 133.35,39.21 120.02,39.21 118.11,41.12 103.82,41.12 95.57,49.37 69.85,49.37 66.04,53.18 JP3.1
SD_IN
  Bottom 0.61: R32.1 138.43,31.91 138.43,36.67 137.16,37.94 IC4.17
SDATA
  Bottom 0.61: IC4.3 134.62,35.4
  Bottom 0.813: 134.62,35.4 132.08,37.94 120.02,37.94 119.06,36.99 112.08,36.99 109.22,39.85 102.87,39.85 94.93,47.78 68.58,47.78 65.72,50.64 JP2.1
SHORT  (via drill 0.65 pad 1.78)
  Top 0.61: v108.58,48.74 v108.58,36.67
  Bottom 0.813: JP24.1 R9.2 108.9,49.05 v108.58,48.74 | T4.3 105.73,27.78 104.46,29.05 104.46,31.97 106.03,33.54 107.67,33.54 108.58,34.45 v108.58,36.67
SHORT2  (via drill 0.65 pad 1.78)
  Top 0.813: v73.66,33.18 v78.74,33.18 | v97.75,40.45 97.75,55.69 v97.79,55.72 | v95.25,66.83 v95.25,70.96
  Bottom 0.813: 26.67,75.41 R36.1 | 26.67,75.41 26.67,76.04 25.79,76.92 IC9.11 | 26.67,75.41 26.71,74.73 38.47,74.73 42.24,70.96 87.63,70.96 | v73.66,33.18 73.66,22.07 76.2,19.53 R40.2 | v97.75,40.45 97.72,40.48 80.01,40.48 78.74,39.21 v78.74,33.18 | v97.79,55.72 97.79,65.88 96.84,66.83 v95.25,66.83 | 87.63,70.96 v95.25,70.96 | JP16.1 87.63,70.96
SHORT_LED
  Bottom 0.813: JP15.1 82.55,92.55 81.92,91.92 R20.2
SPS/LOAD
  Bottom 0.61: IC4.6 142.24,37.31 140.97,38.58 140.97,43.02
  Bottom 0.813: JP4.1 66.36,55.72 71.12,50.96 96.2,50.96 104.78,42.39 119.06,42.39 122.56,45.88 140.02,45.88 140.97,44.93 140.97,43.02
SRESET
  Bottom 0.61: IC4.8 147.32,38.58 146.05,39.85 146.05,43.02
  Bottom 0.813: JP5.1 66.67,58.26 72.39,52.55 97.16,52.55 106.05,43.66 118.11,43.66 121.6,47.15 145.1,47.15 146.05,46.2 146.05,43.02
TASTER  (via drill 0.65 pad 1.78)
  Top 0.813: v80.01,93.82 v92.71,93.82
  Bottom 0.813: JP14.1 v80.01,93.82 | v92.71,93.82 92.71,91.28 93.98,90.01 100.33,90.01 101.6,91.28 101.6,93.82 102.87,95.09 103.83,95.09 S1.1
TEMP
  Bottom 0.813: JP10.1 R35.1 68.58,80.8 R14.2
V_RAIL
  Bottom 0.813: R56.1 61.59,74.77 62.23,75.41 62.23,77.95 62.87,78.58 JP9.1 75.56,78.58 76.2,77.95 R55.1
WIFI_RX
  Bottom 0.813: JP28.1 124.46,73.5 125.41,72.55 125.41,70.33 126.36,69.37 129.54,69.37 130.18,70.01 JP1.1
WIFI_TX
  Bottom 0.813: JP1.2 127.64,74.14 125.73,76.04 JP29.1
XNET_A
  Bottom 0.813: R25.1 155.57,88.11 154.94,88.74 150.5,88.74 | R37.1 150.5,88.74 | 150.5,88.74 141.6,88.74 | 141.6,88.74 J9.4 | 137.16,88.74 141.6,88.74 | 137.16,88.74 124.46,88.74 123.83,88.11 J4.4 | IC1.6 137.16,88.74
XNET_B  (via drill 0.65 pad 1.78)
  Top 0.813: v139.7,77.95 v134.62,77.95
  Bottom 0.813: R24.2 R37.2 150.5,77.31 149.86,77.95 142.88,77.95 | 142.88,77.95 J9.3 | J4.3 125.09,78.58 125.73,77.95 v134.62,77.95 IC1.7 | 142.88,77.95 v139.7,77.95
XNET_RX  (via drill 0.65 pad 1.78)
  Top 0.813: v116.84,81.12 v116.84,69.69
  Bottom 0.813: JP31.1 v116.84,81.12 | v116.84,69.69 120.65,69.69 121.92,68.42 121.92,59.53 122.56,58.9 IC1.1
XNET_S/R  (via drill 0.65 pad 1.78)
  Top 0.813: v117.16,38.89 v117.16,45.56 | v94.61,77.95 v83.19,77.95
  Bottom 0.813: IC1.3 IC1.2 134.62,56.99 133.99,56.36 117.16,56.36 | JP21.1 113.28,38.89 v117.16,38.89 | v117.16,45.56 117.16,56.36 | R5.2 60.96,90.01 62.23,88.74 81.28,88.74 83.19,86.84 v83.19,77.95 | 117.16,56.36 117.16,65.88 115.57,67.47 112.71,67.47 110.49,69.69 105.41,69.69 97.16,77.95 v94.61,77.95
XNET_TX  (via drill 0.65 pad 1.78)
  Top 0.813: v119.38,78.58 v119.38,71.6
  Bottom 0.813: JP30.1 v119.38,78.58 | v119.38,71.6 121.28,71.6 123.83,69.06 123.83,62.07 124.46,61.44 138.43,61.44 139.7,60.17 IC1.4

### Text on the board
Bottom: DCC Zentrale / 12/2020
tValues: LocoNet | Stop/GO | Xnet | Xnet | SEND/RECEIVE | DCC | SHORT | + | + | + | L 6203 | 5V | 12V | Prog | C D E / Gleis | S88N | DC 15V | Roco- / Booster